# Altium schematic sheet 7688A-kit-V2-1.SchDoc
size A4
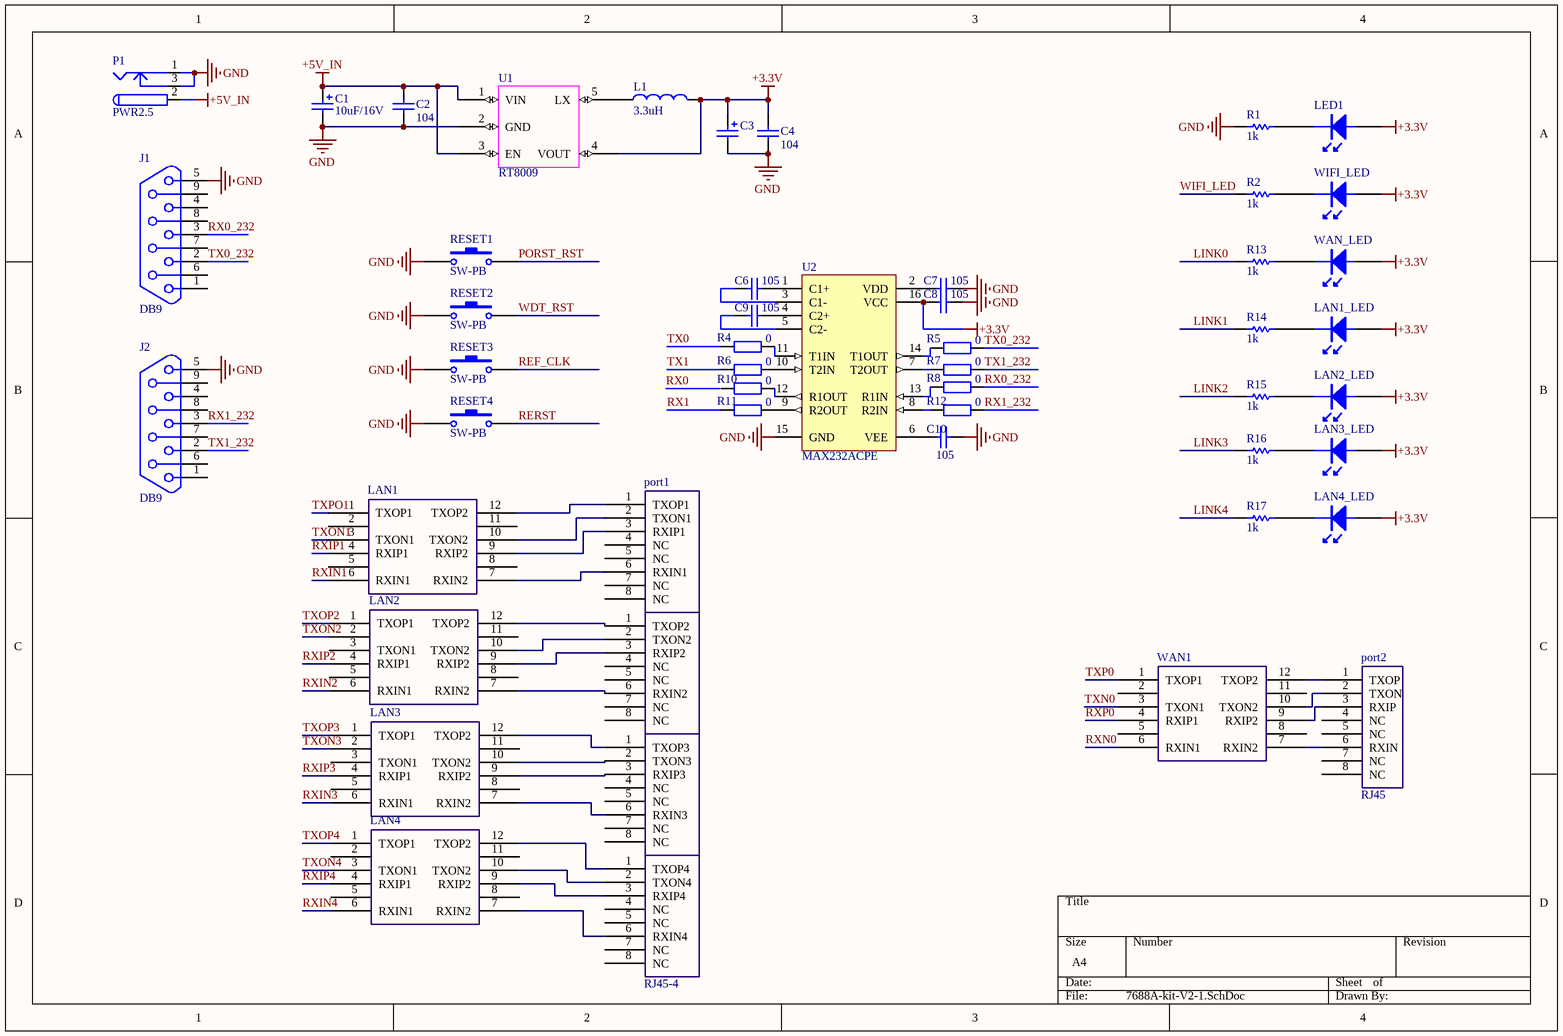
[diagram p0: 7688A-kit-V2-1.SchDoc]

## Parts
C1  10uF/16V  [0805]
C2  104  [0603]
C3  10uF/16V  [0805]  (value not drawn)
C4  104  [0603]
C6  105  [0603]
C7  105  [0603]
C8  105  [0603]
C9  105  [0603]
C10  105  [0603]
J1  DB9  [DB9s]
J2  DB9  [DB9s]
L1  3.3uH  [2520]
LAN1  (no value)  [tf-1016dg]
LAN1_LED  (no value)  [0603LED]
LAN2  (no value)  [tf-1016dg]
LAN2_LED  (no value)  [0603LED]
LAN3  (no value)  [tf-1016dg]
LAN3_LED  (no value)  [0603LED]
LAN4  (no value)  [tf-1016dg]
LAN4_LED  (no value)  [0603LED]
LED1  (no value)  [0603LED]
P1  PWR2.5  [POWER_STK1]
port1  RJ45-4  [RJ45-4]
port2  RJ45  [RJ45-8P8C]
R1  value 1k  [0603]  (hidden comment: Res1)
R2  value 1k  [0603]  (hidden comment: Res1)
R4  0  [0603]
R5  0  [0603]
R6  0  [0603]
R7  0  [0603]
R8  0  [0603]
R10  0  [0603]
R11  0  [0603]
R12  0  [0603]
R13  value 1k  [0603]  (hidden comment: Res1)
R14  value 1k  [0603]  (hidden comment: Res1)
R15  value 1k  [0603]  (hidden comment: Res1)
R16  value 1k  [0603]  (hidden comment: Res1)
R17  value 1k  [0603]  (hidden comment: Res1)
RESET1  SW-PB  [SWITCH]
RESET2  SW-PB  [SWITCH]
RESET3  SW-PB  [SWITCH]
RESET4  SW-PB  [SWITCH]
U1  RT8009  [SOT23-5]
U2  MAX232ACPE  [MAX3232]
WAN1  (no value)  [tf-1016dg]
WAN_LED  (no value)  [0603LED]
WIFI_LED  (no value)  [0603LED]

## Nets
+3.3V: C3.1 C4.2 C8.1 L1.2 LAN1_LED.1 LAN2_LED.1 LAN3_LED.1 LAN4_LED.1 LED1.1 U1.4(VOUT) U2.16(VCC) WAN_LED.1 WIFI_LED.1
+5V_IN: C1.1 C2.2 P1.2 U1.1(VIN) U1.3(EN)
GND: C1.2 C2.1 C3.2 C4.1 C7.2 C8.2 C10.1 J1.5 J2.5 P1.1 P1.3 R1.2 RESET1.1 RESET2.1 RESET3.1 RESET4.1 U1.2(GND) U2.15(GND)
LINK0: R13.2
LINK1: R14.2
LINK2: R15.2
LINK3: R16.2
LINK4: R17.2
PORST_RST: RESET1.2
REF_CLK: RESET3.2
RERST: RESET4.2
RX0_232: J1.3 R8.2
RX1: R11.1
RX1_232: J2.3 R12.2
RXIN1: LAN1.6(RXIN1)
RXIN2: LAN2.6(RXIN1)
RXIN3: LAN3.6(RXIN1)
RXIN4: LAN4.6(RXIN1)
RXIP1: LAN1.4(RXIP1)
RXIP2: LAN2.4(RXIP1)
RXIP3: LAN3.4(RXIP1)
RXIP4: LAN4.4(RXIP1)
RXN0: WAN1.6(RXIN1)
RXP0: WAN1.4(RXIP1)
TX0: R4.1
TX0_232: J1.2 R5.2
TX1: R6.1
TX1_232: J2.2 R7.2
TXN0: WAN1.3(TXON1)
TXON1: LAN1.3(TXON1)
TXON2: LAN2.2
TXON3: LAN3.2
TXON4: LAN4.3(TXON1)
TXOP2: LAN2.1(TXOP1)
TXOP3: LAN3.1(TXOP1)
TXOP4: LAN4.1(TXOP1)
TXP0: WAN1.1(TXOP1)
TXPO1: LAN1.1(TXOP1)
WDT_RST: RESET2.2
WIFI_LED: R2.2
NetC6_1: C6.1 U2.3(C1-)
NetC6_2: C6.2 U2.1(C1+)
NetC7_1: C7.1 U2.2(VDD)
NetC9_1: C9.1 U2.5(C2-)
NetC9_2: C9.2 U2.4(C2+)
NetC10_2: C10.2 U2.6(VEE)
NetL1_1: L1.1 U1.5(LX)
NetLAN1_7: LAN1.7(RXIN2) port1.6(RXIN1)
NetLAN1_9: LAN1.9(RXIP2) port1.3(RXIP1)
NetLAN1_10: LAN1.10(TXON2) port1.2(TXON1)
NetLAN1_12: LAN1.12(TXOP2) port1.1(TXOP1)
NetLAN1_LED_2: LAN1_LED.2 R14.1
NetLAN2_7: LAN2.7(RXIN2) port1.6(RXIN2)
NetLAN2_9: LAN2.9(RXIP2) port1.3(RXIP2)
NetLAN2_10: LAN2.10(TXON2) port1.2(TXON2)
NetLAN2_12: LAN2.12(TXOP2) port1.1(TXOP2)
NetLAN2_LED_2: LAN2_LED.2 R15.1
NetLAN3_7: LAN3.7(RXIN2) port1.6(RXIN3)
NetLAN3_9: LAN3.9(RXIP2) port1.3(RXIP3)
NetLAN3_10: LAN3.10(TXON2) port1.2(TXON3)
NetLAN3_12: LAN3.12(TXOP2) port1.1(TXOP3)
NetLAN3_LED_2: LAN3_LED.2 R16.1
NetLAN4_7: LAN4.7(RXIN2) port1.6(RXIN4)
NetLAN4_9: LAN4.9(RXIP2) port1.3(RXIP4)
NetLAN4_10: LAN4.10(TXON2) port1.2(TXON4)
NetLAN4_12: LAN4.12(TXOP2) port1.1(TXOP4)
NetLAN4_LED_2: LAN4_LED.2 R17.1
NetLED1_2: LED1.2 R1.1
Netport2_1: port2.1(TXOP) WAN1.12(TXOP2)
Netport2_2: port2.2(TXON) WAN1.10(TXON2)
Netport2_3: port2.3(RXIP) WAN1.9(RXIP2)
Netport2_6: port2.6(RXIN) WAN1.7(RXIN2)
NetR2_1: R2.1 WIFI_LED.2
NetR4_2: R4.2 U2.11(T1IN)
NetR5_1: R5.1 U2.14(T1OUT)
NetR6_2: R6.2 U2.10(T2IN)
NetR7_1: R7.1 U2.7(T2OUT)
NetR8_1: R8.1 U2.13(R1IN)
NetR10_2: R10.2 U2.12(R1OUT)
NetR11_2: R11.2 U2.9(R2OUT)
NetR12_1: R12.1 U2.8(R2IN)
NetR13_1: R13.1 WAN_LED.2

Not connected (* = marked no-connect by the designer): J1 1 4 6 7 8 9; J2 1 4 6 7 8 9; LAN1 2 5 8 11; LAN2 3(TXON1) 5 8 11; LAN3 3(TXON1) 5 8 11; LAN4 2 5 8 11; port1 4(NC) 5(NC) 7(NC) 8(NC); port2 4(NC) 5(NC) 7(NC) 8(NC); R10 1; WAN1 2 5 8 11

## Library data of the parts
C1 C3 = Cap Pol3: Polarized Capacitor (Surface Mount); Manufacturer: Generic Components; Class: Passive; Value: 10uF; Published: 08/06/2000; Publisher: Altium Hobart Technology Centre; SubClass: Capacitor
C2 C4 = Cap: Capacitor; Manufacturer: Generic Components; Class: Passive; Value: 100pF; Published: 08/06/2000; Publisher: Altium Hobart Technology Centre; SubClass: Capacitor
C6-C10 = Cap: Capacitor; Value: 100pF; Published: 8-Jun-2000; LatestRevisionDate: 17-Jul-2002; LatestRevisionNote: Re-released for DXP Platform.; PackageReference: RAD-0.3; Publisher: Altium Limited
L1 = INDUCTOR1
LAN1-LAN4 WAN1 = Component_1
LAN1_LED LAN2_LED LAN3_LED LAN4_LED LED1 WAN_LED WIFI_LED = LED
P1 = PWR2.5: Low Voltage Power Supply Connector
R1 R2 R13-R17 = Res1: Resistor; Published: 8-Jun-2000; LatestRevisionDate: 17-Jul-2002; LatestRevisionNote: Re-released for DXP Platform.; PackageReference: AXIAL-0.3; Publisher: Altium Limited
R4-R8 R10-R12 = Res2: Resistor; Published: 8-Jun-2000; LatestRevisionDate: 17-Jul-2002; LatestRevisionNote: Re-released for DXP Platform.; PackageReference: AXIAL-0.4; Publisher: Altium Limited; Value: 0
RESET1-RESET4 = SW-PB: Switch; Published: 24-Mar-1999; LatestRevisionDate: 17-Jul-2002; LatestRevisionNote: Re-released for DXP Platform.; PackageReference: SPST-2; Publisher: Altium Limited
U2 = MAX232ACPE: +5V Powered, Multi-Channel RS-232 Driver/Receiver; PackageDocument: 1997; Published: 16-Jan-2001; LatestRevisionDate: 6-Jun-2005; LatestRevisionNote: Stylized 3D Model Added.; PackageReference: PE16A; Publisher: Altium Limited; Code_JEDEC: MS-001-BB; ComponentLink1Description: Manufacturer Link; ComponentLink1URL: http://www.maxim-ic.com/; ComponentLink2Description: Datasheet; ComponentLink2URL: http://pdfserv.maxim-ic.com/en/ds/MAX220-MAX249.pdf